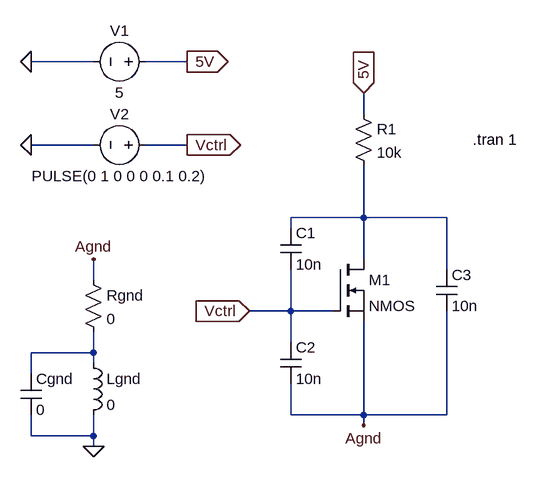
[diagram p0: schematic Draft1.asc]
Draft1.asc, the LTspice schematic file:
Version 4.1
SHEET 1 880 680
WIRE -208 -208 -304 -208
WIRE -64 -208 -128 -208
WIRE 208 -128 208 -160
WIRE -208 -80 -304 -80
WIRE -64 -80 -128 -80
WIRE 208 32 208 -48
WIRE 208 32 96 32
WIRE 336 32 208 32
WIRE 96 48 96 32
WIRE 208 96 208 32
WIRE 336 112 336 32
WIRE -208 128 -208 96
WIRE 96 176 96 112
WIRE 96 176 32 176
WIRE 160 176 96 176
WIRE 96 224 96 176
WIRE -208 240 -208 208
WIRE -208 240 -304 240
WIRE -208 256 -208 240
WIRE -304 272 -304 240
WIRE 96 336 96 288
WIRE 208 336 208 192
WIRE 208 336 96 336
WIRE 336 336 336 176
WIRE 336 336 208 336
WIRE 208 352 208 336
WIRE -304 368 -304 336
WIRE -208 368 -208 336
WIRE -208 368 -304 368
WIRE -208 384 -208 368
FLAG -64 -208 5V
IOPIN -64 -208 Out
FLAG -304 -208 0
FLAG 208 -160 5V
IOPIN 208 -160 In
FLAG -64 -80 Vctrl
IOPIN -64 -80 Out
FLAG -304 -80 0
FLAG 32 176 Vctrl
IOPIN 32 176 In
FLAG -208 384 0
FLAG -208 96 Agnd
FLAG 208 352 Agnd
SYMBOL voltage -112 -208 R90
WINDOW 0 -32 56 VBottom 2
WINDOW 3 32 56 VTop 2
WINDOW 123 0 0 Left 0
WINDOW 39 0 0 Left 0
SYMATTR InstName V1
SYMATTR Value 5
SYMBOL voltage -112 -80 R90
WINDOW 0 -32 56 VBottom 2
WINDOW 3 32 56 VTop 2
WINDOW 123 0 0 Left 0
WINDOW 39 60 56 VTop 2
SYMATTR InstName V2
SYMATTR Value PULSE(0 1 0 0 0 0.1 0.2)
SYMBOL res 192 -144 R0
SYMATTR InstName R1
SYMATTR Value 10k
SYMBOL res -224 112 R0
SYMATTR InstName Rgnd
SYMATTR Value 0
SYMBOL cap -320 272 R0
SYMATTR InstName Cgnd
SYMATTR Value 0
SYMBOL ind -224 240 R0
SYMATTR InstName Lgnd
SYMATTR Value 0
SYMATTR SpiceLine Rser=1m
SYMBOL nmos 160 96 R0
SYMATTR InstName M1
SYMBOL cap 80 48 R0
SYMATTR InstName C1
SYMATTR Value 10n
SYMBOL cap 80 224 R0
SYMATTR InstName C2
SYMATTR Value 10n
SYMBOL cap 320 112 R0
SYMATTR InstName C3
SYMATTR Value 10n
TEXT 376 -88 Left 2 !.tran 1

The netlist it stands for:
* Draft1.asc
V1 5V 0 5
V2 Vctrl 0 PULSE(0 1 0 0 0 0.1 0.2)
R1 5V N001 10k
Rgnd Agnd N002 0
Cgnd N002 0 0
Lgnd N002 0 0 Rser=1m
M1 N001 Vctrl Agnd Agnd NMOS
C1 N001 Vctrl 10n
C2 Vctrl Agnd 10n
C3 N001 Agnd 10n
.model NMOS NMOS
.model PMOS PMOS
.lib standard.mos
.tran 1
.backanno
.end